# EAGLE design Octaplexerv6.1 (EAGLE 7.5.0)
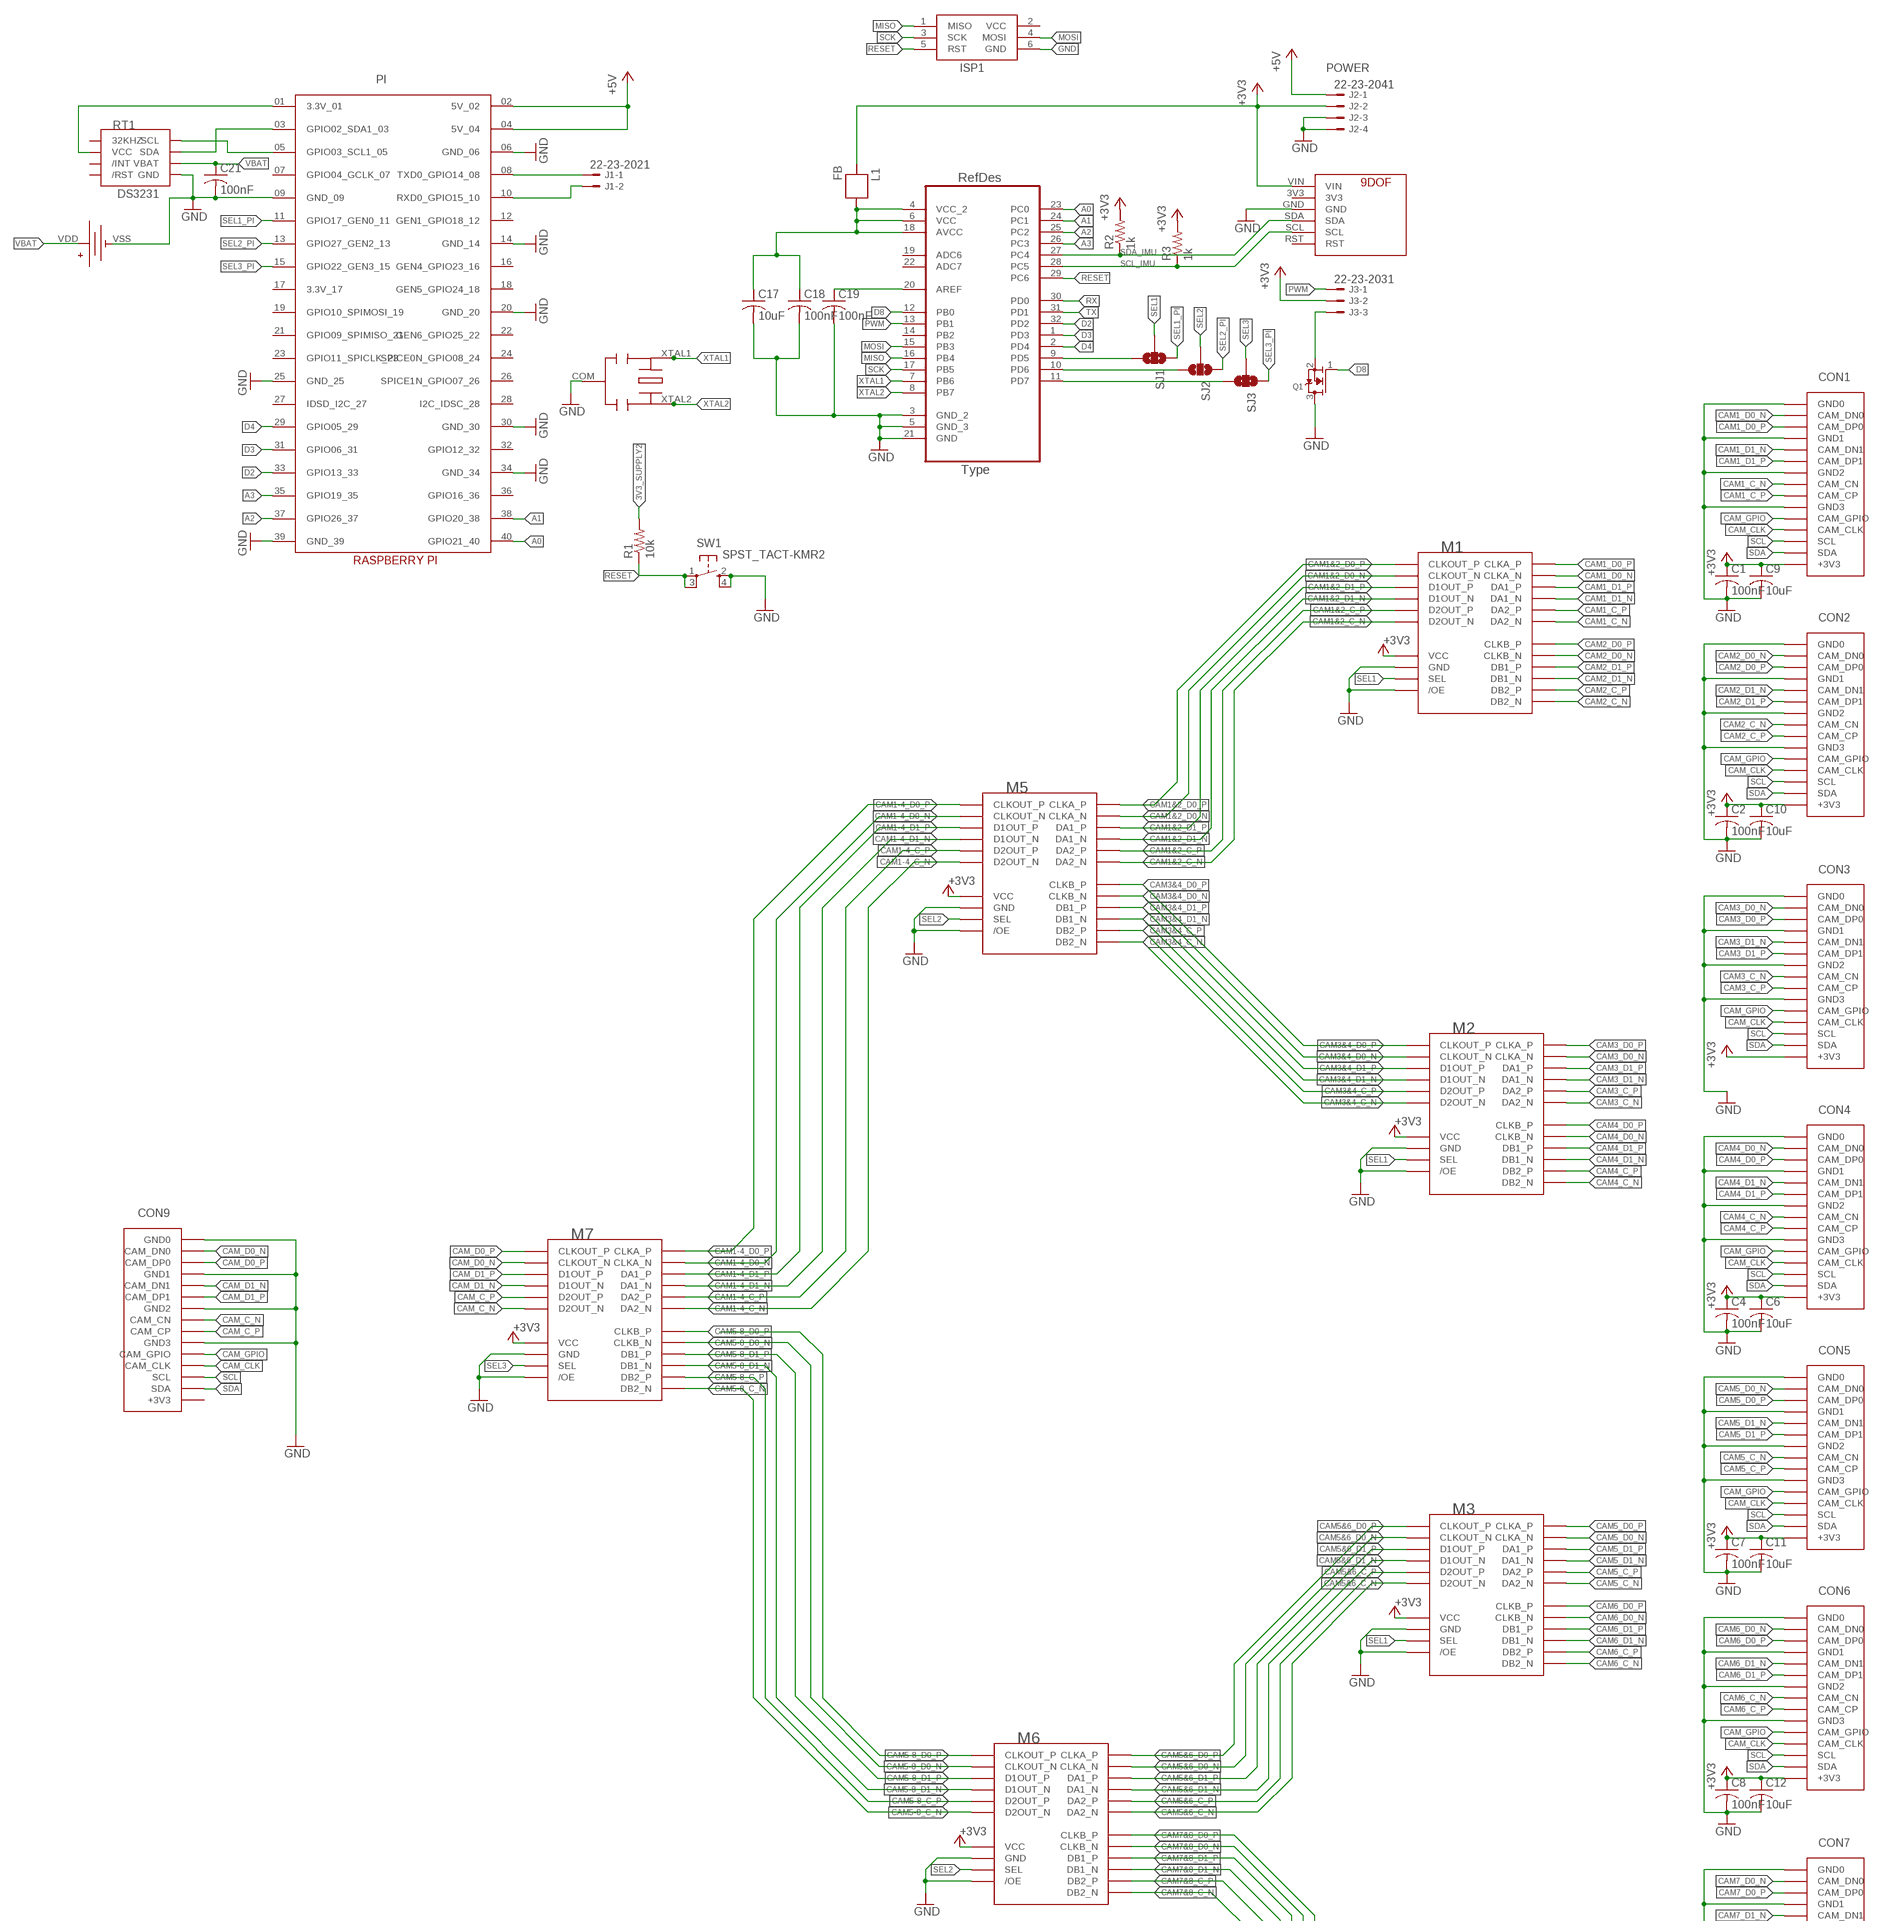
[diagram p0: schematic, sheet 1, part 1 of 2]
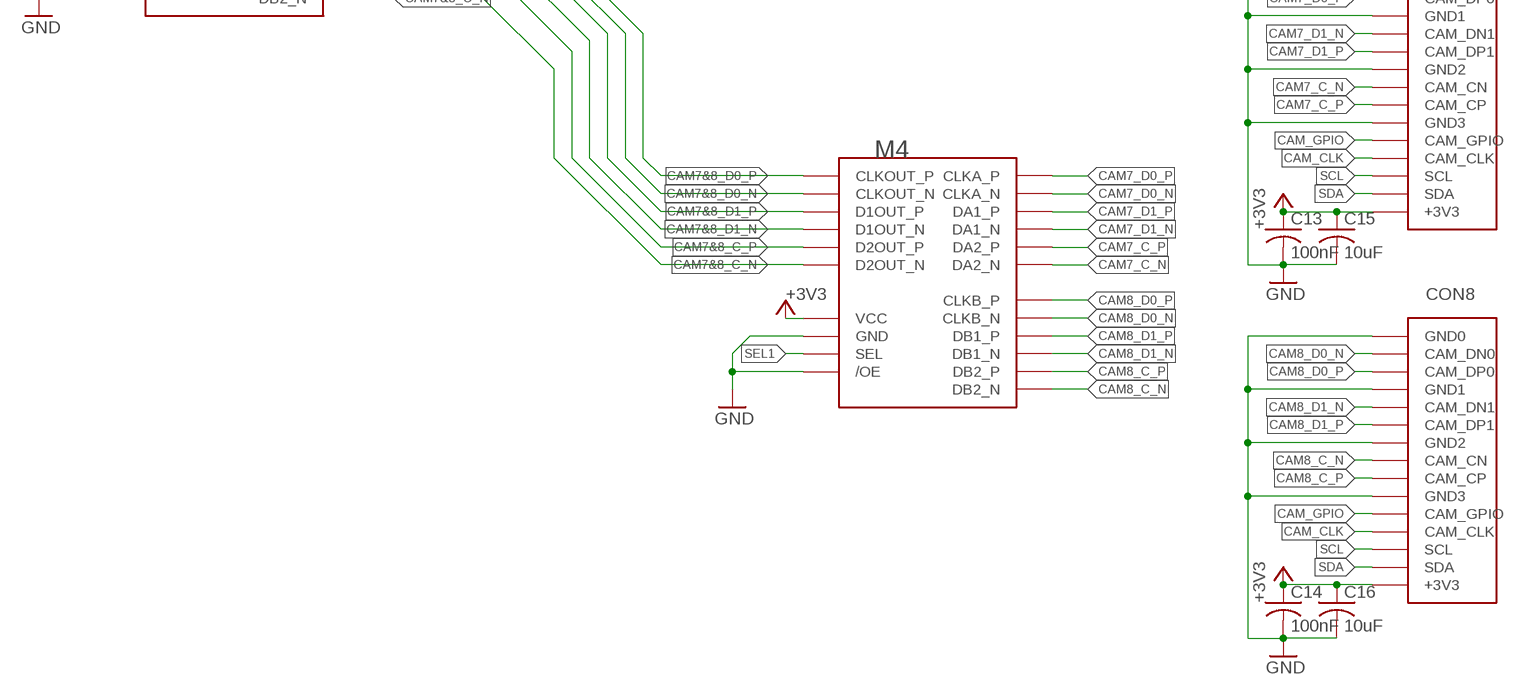
[diagram p1: schematic, sheet 1, part 2 of 2]

## Parts
C1  100nF  C-USC0603  [C0603]
C2  100nF  C-USC0603  [C0603]
C4  100nF  C-USC0603  [C0603]
C6  10uF  C-USC0603  [C0603]
C7  100nF  C-USC0603  [C0603]
C8  100nF  C-USC0603  [C0603]
C9  10uF  C-USC0603  [C0603]
C10  10uF  C-USC0603  [C0603]
C11  10uF  C-USC0603  [C0603]
C12  10uF  C-USC0603  [C0603]
C13  100nF  C-USC0603  [C0603]
C14  100nF  C-USC0603  [C0603]
C15  10uF  C-USC0603  [C0603]
C16  10uF  C-USC0603  [C0603]
C17  10uF  C-USC0603  [C0603]
C18  100nF  C-USC0603  [C0603]
C19  100nF  C-USC0603  [C0603]
C21  100nF  C-USC0603  [C0603]
CON1  SLW15S-1C7LF  [SLW15R-1C7LF]
CON2  SLW15S-1C7LF  [SLW15R-1C7LF]
CON3  SLW15S-1C7LF  [SLW15R-1C7LF]
CON4  SLW15S-1C7LF  [SLW15R-1C7LF]
CON5  SLW15S-1C7LF  [SLW15R-1C7LF]
CON6  SLW15S-1C7LF  [SLW15R-1C7LF]
CON7  SLW15S-1C7LF  [SLW15R-1C7LF]
CON8  SLW15S-1C7LF  [SLW15R-1C7LF]
CON9  SLW15S-1C7LF  [SLW15R-1C7LF]
ISP1  AVRISP-6  [AVRISP]
J1  22-23-2021  [22-23-2021]
J2  22-23-2041  [22-23-2041]
J3  22-23-2031  [22-23-2031]
L1  FB  [0603]
M1  FSA642  [FSA642]
M2  FSA642  [FSA642]
M3  FSA642  [FSA642]
M4  FSA642  [FSA642]
M5  FSA642  [FSA642]
M6  FSA642  [FSA642]
M7  FSA642  [FSA642]
PI  RASPBERRYPI_SHIELD  [RASPBERRYPI_SHIELD]
Q1  MOSFET-NREFLOW  [SOT23]
R1  10k  R-US_R0603  [R0603]
R2  1k  R-US_R0603  [R0603]
R3  1k  R-US_R0603  [R0603]
RT1  DS3231M  [SO-8]
S1  CR-1220/HFN  [CR-1220/HFN]
SJ1  SOLDERJUMPER_2WAYPASTE2&3  [SJ_3_PASTE2&3]
SJ2  SOLDERJUMPER_2WAYPASTE2&3  [SJ_3_PASTE2&3]
SJ3  SOLDERJUMPER_2WAYPASTE2&3  [SJ_3_PASTE2&3]
SW1  SPST_TACT-KMR2  [KMR2]
U1  ATMEGA328P-AU  [QFP80P900X900X120-32N]
U$2  9DOF-BNO055  [9DOF_FLAT]
X1  RESONATOR-PRQC  [PRQC]

## Nets
3V3_SUPPLY2: C17.1 C18.1 L1.1 R1.2 U1.4(VCC_2) U1.6(VCC) U1.18(AVCC)
+3V3: C1.1 C2.1 C4.1 C6.1 C7.1 C8.1 C9.1 C10.1 C11.1 C12.1 C13.1 C14.1 C15.1 C16.1 CON1.3.3V(+3V3) CON2.3.3V(+3V3) CON3.3.3V(+3V3) CON4.3.3V(+3V3) CON5.3.3V(+3V3) CON6.3.3V(+3V3) CON7.3.3V(+3V3) CON8.3.3V(+3V3) J2.2 J3.2 L1.2 M1.VCC M2.VCC M3.VCC M4.VCC M5.VCC M6.VCC M7.VCC R2.2 R3.2 U$2.VIN
+5V: J2.1 PI.02(5V_02) PI.04(5V_04)
A0: PI.40(GPIO21_40) U1.23(PC0)
A1: PI.38(GPIO20_38) U1.24(PC1)
A2: PI.37(GPIO26_37) U1.25(PC2)
A3: PI.35(GPIO19_35) U1.26(PC3)
CAM1&2_C_N: M1.D2N(D2OUT_N) M5.DA2N(DA2_N)
CAM1&2_C_P: M1.D2P(D2OUT_P) M5.DA2P(DA2_P)
CAM1&2_D0_N: M1.CLKN(CLKOUT_N) M5.CLKAN(CLKA_N)
CAM1&2_D0_P: M1.CLKP(CLKOUT_P) M5.CLKAP(CLKA_P)
CAM1&2_D1_N: M1.D1N(D1OUT_N) M5.DA1N(DA1_N)
CAM1&2_D1_P: M1.D1P(D1OUT_P) M5.DA1P(DA1_P)
CAM1-4_C_N: M5.D2N(D2OUT_N) M7.DA2N(DA2_N)
CAM1-4_C_P: M5.D2P(D2OUT_P) M7.DA2P(DA2_P)
CAM1-4_D0_N: M5.CLKN(CLKOUT_N) M7.CLKAN(CLKA_N)
CAM1-4_D0_P: M5.CLKP(CLKOUT_P) M7.CLKAP(CLKA_P)
CAM1-4_D1_N: M5.D1N(D1OUT_N) M7.DA1N(DA1_N)
CAM1-4_D1_P: M5.D1P(D1OUT_P) M7.DA1P(DA1_P)
CAM1_C_N: CON1.CAM_C_N(CAM_CN) M1.DA2N(DA2_N)
CAM1_C_P: CON1.CAM_C_P(CAM_CP) M1.DA2P(DA2_P)
CAM1_D0_N: CON1.CAM_D0_N(CAM_DN0) M1.CLKAN(CLKA_N)
CAM1_D0_P: CON1.CAM_D0_P(CAM_DP0) M1.CLKAP(CLKA_P)
CAM1_D1_N: CON1.CAM_D1_N(CAM_DN1) M1.DA1N(DA1_N)
CAM1_D1_P: CON1.CAM_D1_P(CAM_DP1) M1.DA1P(DA1_P)
CAM2_C_N: CON2.CAM_C_N(CAM_CN) M1.DB2N(DB2_N)
CAM2_C_P: CON2.CAM_C_P(CAM_CP) M1.DB2P(DB2_P)
CAM2_D0_N: CON2.CAM_D0_N(CAM_DN0) M1.CLKBN(CLKB_N)
CAM2_D0_P: CON2.CAM_D0_P(CAM_DP0) M1.CLKBP(CLKB_P)
CAM2_D1_N: CON2.CAM_D1_N(CAM_DN1) M1.DB1N(DB1_N)
CAM2_D1_P: CON2.CAM_D1_P(CAM_DP1) M1.DB1P(DB1_P)
CAM3&4_C_N: M2.D2N(D2OUT_N) M5.DB2N(DB2_N)
CAM3&4_C_P: M2.D2P(D2OUT_P) M5.DB2P(DB2_P)
CAM3&4_D0_N: M2.CLKN(CLKOUT_N) M5.CLKBN(CLKB_N)
CAM3&4_D0_P: M2.CLKP(CLKOUT_P) M5.CLKBP(CLKB_P)
CAM3&4_D1_N: M2.D1N(D1OUT_N) M5.DB1N(DB1_N)
CAM3&4_D1_P: M2.D1P(D1OUT_P) M5.DB1P(DB1_P)
CAM3_C_N: CON3.CAM_C_N(CAM_CN) M2.DA2N(DA2_N)
CAM3_C_P: CON3.CAM_C_P(CAM_CP) M2.DA2P(DA2_P)
CAM3_D0_N: CON3.CAM_D0_N(CAM_DN0) M2.CLKAN(CLKA_N)
CAM3_D0_P: CON3.CAM_D0_P(CAM_DP0) M2.CLKAP(CLKA_P)
CAM3_D1_N: CON3.CAM_D1_N(CAM_DN1) M2.DA1N(DA1_N)
CAM3_D1_P: CON3.CAM_D1_P(CAM_DP1) M2.DA1P(DA1_P)
CAM4_C_N: CON4.CAM_C_N(CAM_CN) M2.DB2N(DB2_N)
CAM4_C_P: CON4.CAM_C_P(CAM_CP) M2.DB2P(DB2_P)
CAM4_D0_N: CON4.CAM_D0_N(CAM_DN0) M2.CLKBN(CLKB_N)
CAM4_D0_P: CON4.CAM_D0_P(CAM_DP0) M2.CLKBP(CLKB_P)
CAM4_D1_N: CON4.CAM_D1_N(CAM_DN1) M2.DB1N(DB1_N)
CAM4_D1_P: CON4.CAM_D1_P(CAM_DP1) M2.DB1P(DB1_P)
CAM5&6_C_N: M3.D2N(D2OUT_N) M6.DA2N(DA2_N)
CAM5&6_C_P: M3.D2P(D2OUT_P) M6.DA2P(DA2_P)
CAM5&6_D0_N: M3.CLKN(CLKOUT_N) M6.CLKAN(CLKA_N)
CAM5&6_D0_P: M3.CLKP(CLKOUT_P) M6.CLKAP(CLKA_P)
CAM5&6_D1_N: M3.D1N(D1OUT_N) M6.DA1N(DA1_N)
CAM5&6_D1_P: M3.D1P(D1OUT_P) M6.DA1P(DA1_P)
CAM5-8_C_N: M6.D2N(D2OUT_N) M7.DB2N(DB2_N)
CAM5-8_C_P: M6.D2P(D2OUT_P) M7.DB2P(DB2_P)
CAM5-8_D0_N: M6.CLKN(CLKOUT_N) M7.CLKBN(CLKB_N)
CAM5-8_D0_P: M6.CLKP(CLKOUT_P) M7.CLKBP(CLKB_P)
CAM5-8_D1_N: M6.D1N(D1OUT_N) M7.DB1N(DB1_N)
CAM5-8_D1_P: M6.D1P(D1OUT_P) M7.DB1P(DB1_P)
CAM5_C_N: CON5.CAM_C_N(CAM_CN) M3.DA2N(DA2_N)
CAM5_C_P: CON5.CAM_C_P(CAM_CP) M3.DA2P(DA2_P)
CAM5_D0_N: CON5.CAM_D0_N(CAM_DN0) M3.CLKAN(CLKA_N)
CAM5_D0_P: CON5.CAM_D0_P(CAM_DP0) M3.CLKAP(CLKA_P)
CAM5_D1_N: CON5.CAM_D1_N(CAM_DN1) M3.DA1N(DA1_N)
CAM5_D1_P: CON5.CAM_D1_P(CAM_DP1) M3.DA1P(DA1_P)
CAM6_C_N: CON6.CAM_C_N(CAM_CN) M3.DB2N(DB2_N)
CAM6_C_P: CON6.CAM_C_P(CAM_CP) M3.DB2P(DB2_P)
CAM6_D0_N: CON6.CAM_D0_N(CAM_DN0) M3.CLKBN(CLKB_N)
CAM6_D0_P: CON6.CAM_D0_P(CAM_DP0) M3.CLKBP(CLKB_P)
CAM6_D1_N: CON6.CAM_D1_N(CAM_DN1) M3.DB1N(DB1_N)
CAM6_D1_P: CON6.CAM_D1_P(CAM_DP1) M3.DB1P(DB1_P)
CAM7&8_C_N: M4.D2N(D2OUT_N) M6.DB2N(DB2_N)
CAM7&8_C_P: M4.D2P(D2OUT_P) M6.DB2P(DB2_P)
CAM7&8_D0_N: M4.CLKN(CLKOUT_N) M6.CLKBN(CLKB_N)
CAM7&8_D0_P: M4.CLKP(CLKOUT_P) M6.CLKBP(CLKB_P)
CAM7&8_D1_N: M4.D1N(D1OUT_N) M6.DB1N(DB1_N)
CAM7&8_D1_P: M4.D1P(D1OUT_P) M6.DB1P(DB1_P)
CAM7_C_N: CON7.CAM_C_N(CAM_CN) M4.DA2N(DA2_N)
CAM7_C_P: CON7.CAM_C_P(CAM_CP) M4.DA2P(DA2_P)
CAM7_D0_N: CON7.CAM_D0_N(CAM_DN0) M4.CLKAN(CLKA_N)
CAM7_D0_P: CON7.CAM_D0_P(CAM_DP0) M4.CLKAP(CLKA_P)
CAM7_D1_N: CON7.CAM_D1_N(CAM_DN1) M4.DA1N(DA1_N)
CAM7_D1_P: CON7.CAM_D1_P(CAM_DP1) M4.DA1P(DA1_P)
CAM8_C_N: CON8.CAM_C_N(CAM_CN) M4.DB2N(DB2_N)
CAM8_C_P: CON8.CAM_C_P(CAM_CP) M4.DB2P(DB2_P)
CAM8_D0_N: CON8.CAM_D0_N(CAM_DN0) M4.CLKBN(CLKB_N)
CAM8_D0_P: CON8.CAM_D0_P(CAM_DP0) M4.CLKBP(CLKB_P)
CAM8_D1_N: CON8.CAM_D1_N(CAM_DN1) M4.DB1N(DB1_N)
CAM8_D1_P: CON8.CAM_D1_P(CAM_DP1) M4.DB1P(DB1_P)
CAM_C_N: CON9.CAM_C_N(CAM_CN) M7.D2N(D2OUT_N)
CAM_C_P: CON9.CAM_C_P(CAM_CP) M7.D2P(D2OUT_P)
CAM_CLK: CON1.CAM_CLK CON2.CAM_CLK CON3.CAM_CLK CON4.CAM_CLK CON5.CAM_CLK CON6.CAM_CLK CON7.CAM_CLK CON8.CAM_CLK CON9.CAM_CLK
CAM_D0_N: CON9.CAM_D0_N(CAM_DN0) M7.CLKN(CLKOUT_N)
CAM_D0_P: CON9.CAM_D0_P(CAM_DP0) M7.CLKP(CLKOUT_P)
CAM_D1_N: CON9.CAM_D1_N(CAM_DN1) M7.D1N(D1OUT_N)
CAM_D1_P: CON9.CAM_D1_P(CAM_DP1) M7.D1P(D1OUT_P)
CAM_GPIO: CON1.CAM_GPIO CON2.CAM_GPIO CON3.CAM_GPIO CON4.CAM_GPIO CON5.CAM_GPIO CON6.CAM_GPIO CON7.CAM_GPIO CON8.CAM_GPIO CON9.CAM_GPIO
D2: PI.33(GPIO13_33) U1.32(PD2)
D3: PI.31(GPIO06_31) U1.1(PD3)
D4: PI.29(GPIO05_29) U1.2(PD4)
D8: Q1.1(G) U1.12(PB0)
GND: C1.2 C2.2 C4.2 C6.2 C7.2 C8.2 C9.2 C10.2 C11.2 C12.2 C13.2 C14.2 C15.2 C16.2 C17.2 C18.2 C19.2 C21.2 CON1.GND1 CON1.GND2 CON1.GND3 CON1.GND(GND0) CON2.GND1 CON2.GND2 CON2.GND3 CON2.GND(GND0) CON3.GND1 CON3.GND2 CON3.GND3 CON3.GND(GND0) CON4.GND1 CON4.GND2 CON4.GND3 CON4.GND(GND0) CON5.GND1 CON5.GND2 CON5.GND3 CON5.GND(GND0) CON6.GND1 CON6.GND2 CON6.GND3 CON6.GND(GND0) CON7.GND1 CON7.GND2 CON7.GND3 CON7.GND(GND0) CON8.GND1 CON8.GND2 CON8.GND3 CON8.GND(GND0) CON9.GND1 CON9.GND2 CON9.GND3 CON9.GND(GND0) ISP1.6(GND) J2.3 J2.4 M1./OE M1.GND M2./OE M2.GND M3./OE M3.GND M4./OE M4.GND M5./OE M5.GND M6./OE M6.GND M7./OE M7.GND PI.06(GND_06) PI.09(GND_09) PI.14(GND_14) PI.20(GND_20) PI.25(GND_25) PI.30(GND_30) PI.34(GND_34) PI.39(GND_39) Q1.3(D) RT1.5(GND) S1.VSS SW1.2(S) SW1.4(S1) U1.3(GND_2) U1.5(GND_3) U1.21(GND) U$2.GND X1.COM
MISO: ISP1.1(MISO) U1.16(PB4)
MOSI: ISP1.4(MOSI) U1.15(PB3)
N$1: J1.1 PI.08(TXD0_GPIO14_08)
N$2: SJ3.3 U1.11(PD7)
N$3: C19.1 U1.20(AREF)
N$4: SJ2.3 U1.10(PD6)
N$5: SJ1.3 U1.9(PD5)
N$7: J1.2 PI.10(RXD0_GPIO15_10)
N$8: J3.3 Q1.2(S)
N$10: PI.03(GPIO02_SDA1_03) RT1.7(SDA)
N$11: PI.05(GPIO03_SCL1_05) RT1.8(SCL)
N$12: PI.01(3.3V_01) RT1.2(VCC)
PWM: J3.1 U1.13(PB1)
RESET: ISP1.5(RST) R1.1 SW1.1(P) SW1.3(P1) U1.29(PC6)
RX: U1.30(PD0)
SCK: ISP1.3(SCK) U1.17(PB5)
SCL: CON1.SCL CON2.SCL CON3.SCL CON4.SCL CON5.SCL CON6.SCL CON7.SCL CON8.SCL CON9.SCL
SCL_IMU: R3.1 U1.28(PC5) U$2.SCL
SDA: CON1.SDA CON2.SDA CON3.SDA CON4.SDA CON5.SDA CON6.SDA CON7.SDA CON8.SDA CON9.SDA
SDA_IMU: R2.1 U1.27(PC4) U$2.SDA
SEL1: M1.SEL M2.SEL M3.SEL M4.SEL SJ1.2
SEL1_PI: PI.11(GPIO17_GEN0_11) SJ1.1
SEL2: M5.SEL M6.SEL SJ2.2
SEL2_PI: PI.13(GPIO27_GEN2_13) SJ2.1
SEL3: M7.SEL SJ3.2
SEL3_PI: PI.15(GPIO22_GEN3_15) SJ3.1
TX: U1.31(PD1)
VBAT: C21.1 RT1.6(VBAT) S1.VDD
XTAL1: U1.7(PB6) X1.XTAL1
XTAL2: U1.8(PB7) X1.XTAL2
Unconnected: CON9.3.3V(+3V3) PI.07(GPIO04_GCLK_07) PI.12(GEN1_GPIO18_12) PI.16(GEN4_GPIO23_16) PI.17(3.3V_17) PI.18(GEN5_GPIO24_18) PI.19(GPIO10_SPIMOSI_19) PI.21(GPIO09_SPIMISO_21) PI.22(GEN6_GPIO25_22) PI.23(GPIO11_SPICLK_23) PI.24(SPICE0N_GPIO08_24) PI.26(SPICE1N_GPIO07_26) PI.27(IDSD_I2C_27) PI.28(I2C_IDSC_28) PI.32(GPIO12_32) PI.36(GPIO16_36) RT1.1(32KHZ) RT1.3(/INT) RT1.4(/RST) U1.14(PB2) U1.19(ADC6) U1.22(ADC7) U$2.3V3 U$2.RST

## Notes on the sheet
- POWER

## Power pins joined to a net without a drawn wire
VCC: ISP1.2(VCC)

## Library data of the parts
C1 C2 C4 C6-C19 C21 = adafruit:C-US: CAPACITOR, American symbol
CON1-CON9 = MSGC:SLW15S-1C7LF
ISP1 = adafruit:AVRISP: AVR ISP HEADER Standard 6 pin header for AVR programming
J1 = con-molex:22-23-2021: .100" (2.54mm) Center Header - 2 Pin; MF: MOLEX; MPN: 22-23-2021; OC_FARNELL: 1462926; OC_NEWARK: 25C3832
J2 = con-molex:22-23-2041: .100" (2.54mm) Center Header - 4 Pin; MF: MOLEX; MPN: 22-23-2041; OC_FARNELL: 1462920; OC_NEWARK: 38C0355
J3 = con-molex:22-23-2031: .100" (2.54mm) Center Header - 3 Pin; MF: MOLEX; MPN: 22-23-2031; OC_FARNELL: 1462950; OC_NEWARK: 30C0862
L1 = SparkFun-Passives:FB
M1-M7 = MSGC:FSA642
PI = MSGC:RASPBERRYPI_SHIELD
Q1 = adafruit:MOSFET-N: N-Channel Mosfet 2N7002E - 60V 260mA SOT23 [Digikey: 2N7002ET1GOSTR-ND] - REEL BSH103 - 30V 850mA SOT23 [Digikey: 568-5013-1-ND]
R1-R3 = adafruit:R-US_: RESISTOR, American symbol
RT1 = MSGC:DS3231M
S1 = MSGC:CR-1220/HFN
SJ1-SJ3 = SparkFun-Retired:SOLDERJUMPER_2WAY: Solder Jumper 2 way solder jumper
SW1 = adafruit:SPST_TACT: SMT 6mm switch, EVQQ2 series http://www.ladyada.net/library/eagle
U1 = Atmel-ATMEGA328P-AU:ATMEGA328P-AU; DESCRIPTION: 8-bit Microcontroller with In-System Programmable Flash; MPN: ATMEGA328P-AU; OC_FARNELL: 1715486; OC_NEWARK: 14R4631; PACKAGE: TQFP-32; SUPPLIER: Atmel
U$2 = MSGC:9DOF-BNO055
X1 = MSGC:RESONATOR-PRQC

## Board
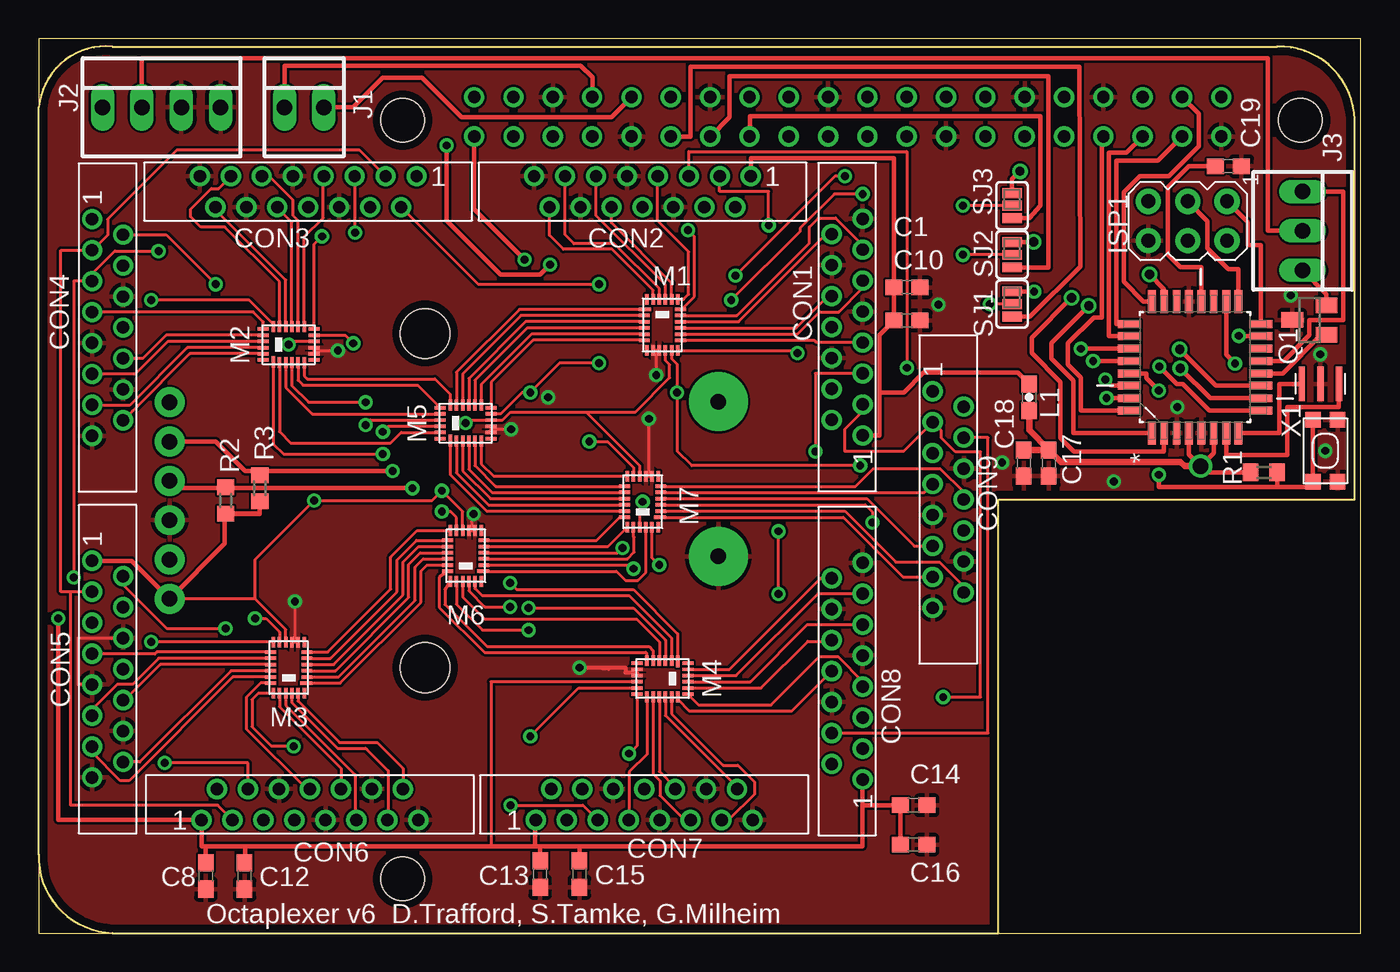
[diagram p2: board, top side]
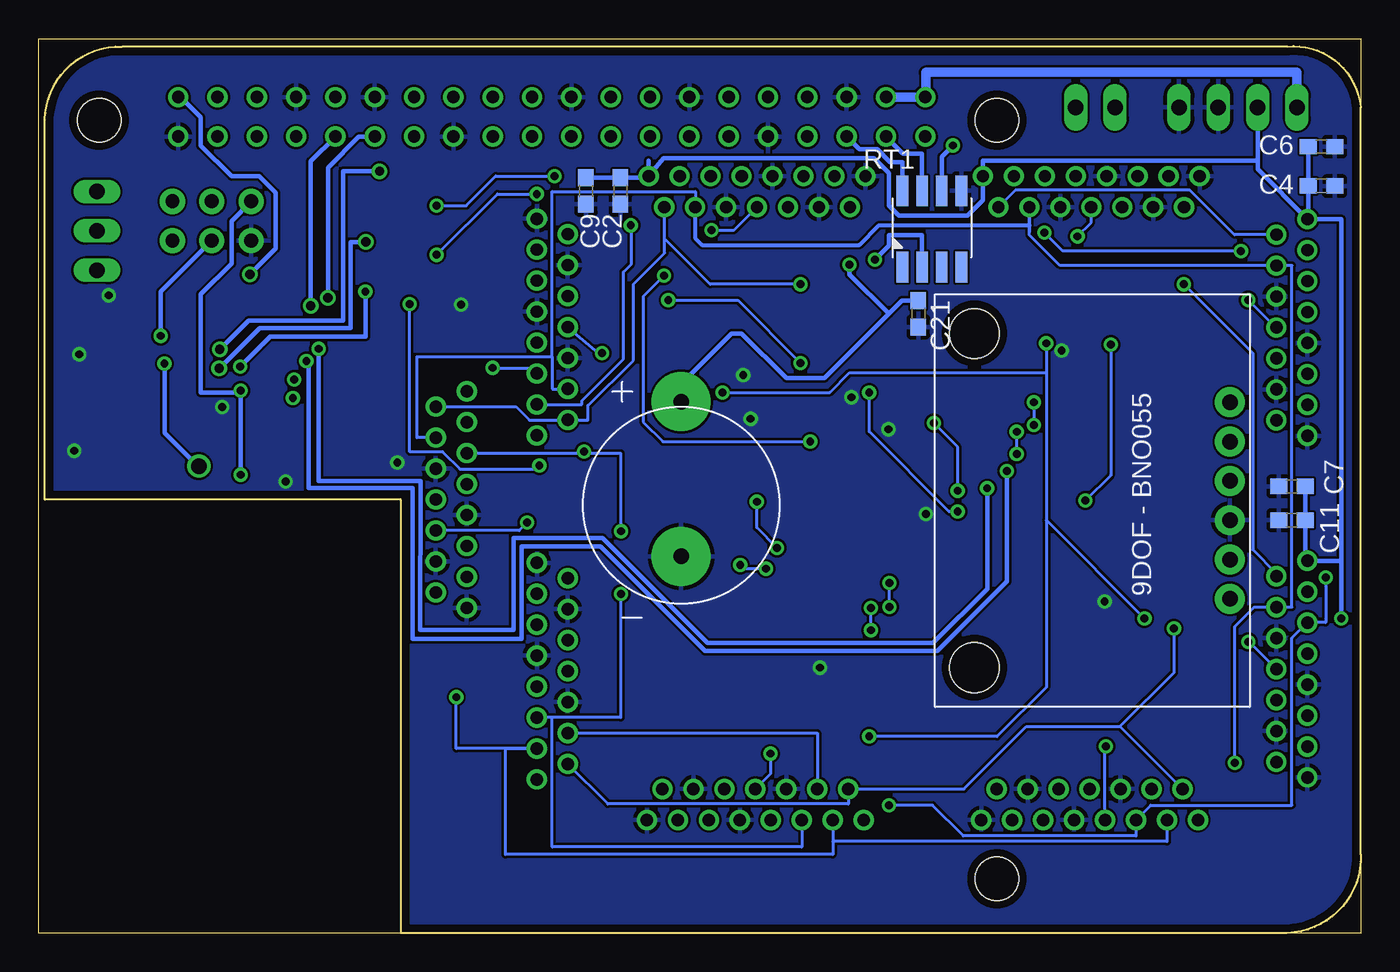
[diagram p3: board, bottom side, seen from below]

Size 85.39 x 57.77 mm. Coordinates in mm from the lower left corner, seen from the top.
Outline: 0,0 85.39,0 85.39,57.77 0,57.77 0,0
Copper layers (1*16): Top 0.035mm / dielectric 1.5mm / Bottom 0.035mm
Design rules "default *": minimum track width 8mil, minimum drill 20mil, track to track 6mil, track to pad 6mil, pad to pad 6mil, via to via 6mil, smd to smd 6mil, copper to edge 20mil, drill to drill 8mil, minimum pad ring 10mil, minimum via ring 8mil, stop-mask expansion 4mil, vias tented up to drill 0mil, thermal gap 10mil

### Footprints (pad centres in the part's own frame; a part is rotated, then mirrored left to right if it is on the bottom)
C0603 = smd 1.1 x 1: 1 -0.85,0; 2 0.85,0
SLW15R-1C7LF = drill 0.8: 3.3V 0,0; CAM_C_N 7,2; CAM_C_P 6,0; CAM_CLK 3,2; CAM_D0_N 13,2; CAM_D0_P 12,0; CAM_D1_N 10,0; CAM_D1_P 9,2; CAM_GPIO 4,0; GND 5,2; GND1 8,0; GND2 11,2; GND3 14,0; SCL 2,0; SDA 1,2
AVRISP = drill 0.9 pad 1.626: 1 -1.27,2.54; 2 1.27,2.54; 3 -1.27,0; 4 1.27,0; 5 -1.27,-2.54; 6 1.27,-2.54
22-23-2021 = drill 1 long: 1 -1.27,0; 2 1.27,0
22-23-2041 = drill 1 long: 1 -3.81,0; 2 -1.27,0; 3 1.27,0; 4 3.81,0
22-23-2031 = drill 1 long: 1 -2.54,0; 2 0,0; 3 2.54,0
0603 = smd 1.1 x 1: 1 -0.85,0; 2 0.85,0
FSA642 = smd 0.225 x 0.703: /OE -0.6,-1.649; CLKBN -0.6,1.649; CLKBP -0.2,1.649; DA2N 1,-1.649; DB1N 0.2,1.649; DB1P 0.6,1.649; DB2P 1,1.649; GND -0.2,-1.649; NC1 -1,-1.649; NC2 -1,1.649; SEL 0.6,-1.649; VCC 0.2,-1.649 | smd 0.703 x 0.225: CLKAN 1.169,0.2; CLKAP 1.169,0.6; CLKN -1.169,0.6; D1N -1.169,-0.2; D1P -1.169,0.2; D2N -1.169,-1; D2P -1.169,-0.6; DA1N 1.169,-0.6; DA1P 1.169,-0.2; DA2P 1.169,-1; DB2N 1.169,1 | smd 0.763 x 0.225: CLKP -1.119,1
RASPBERRYPI_SHIELD = drill 0.8: 01 8.128,51.46; 02 8.128,54; 03 10.668,51.46; 04 10.668,54; 05 13.208,51.46; 06 13.208,54; 07 15.748,51.46; 08 15.748,54; 09 18.288,51.46; 10 18.288,54; 11 20.828,51.46; 12 20.828,54; 13 23.368,51.46; 14 23.368,54; 15 25.908,51.46; 16 25.908,54; 17 28.448,51.46; 18 28.448,54; 19 30.988,51.46; 20 30.988,54; 21 33.528,51.46; 22 33.528,54; 23 36.068,51.46; 24 36.068,54; 25 38.608,51.46; 26 38.608,54; 27 41.148,51.46; 28 41.148,54; 29 43.688,51.46; 30 43.688,54; 31 46.228,51.46; 32 46.228,54; 33 48.768,51.46; 34 48.768,54; 35 51.308,51.46; 36 51.308,54; 37 53.848,51.46; 38 53.848,54; 39 56.388,51.46; 40 56.388,54 | hole 2.8: 3.5,52.5; 3.5,3.5; 61.5,52.5
SOT23 = smd 1 x 1.4: 1 -0.95,-1.1; 2 0.95,-1.1; 3 0,1.1
R0603 = smd 1 x 1.1: 1 -0.85,0; 2 0.85,0
SO-8 = smd 0.762 x 1.98: 1 0,0; 2 1.27,0; 3 2.54,0; 4 3.81,0; 5 3.81,4.93; 6 2.54,4.93; 7 1.27,4.93; 8 0,4.93
CR-1220/HFN = drill 1 pad 3.81: VDD 0,0; VSS 0,10
SJ_3_PASTE2&3 = smd 0.635 x 1.27: 1 -0.813,0; 2 0,0; 3 0.813,0
KMR2 = smd 1 x 1: 1 2,0.8; 2 2,-0.8; 3 -2,0.8; 4 -2,-0.8
QFP80P900X900X120-32N = smd 1.473 x 0.508: 1 -4.242,2.794; 2 -4.242,2.007; 3 -4.242,1.194; 4 -4.242,0.406; 5 -4.242,-0.406; 6 -4.242,-1.194; 7 -4.242,-2.007; 8 -4.242,-2.794; 17 4.242,-2.794; 18 4.242,-2.007; 19 4.242,-1.194; 20 4.242,-0.406; 21 4.242,0.406; 22 4.242,1.194; 23 4.242,2.007; 24 4.242,2.794 | smd 0.508 x 1.473: 9 -2.794,-4.242; 10 -2.007,-4.242; 11 -1.194,-4.242; 12 -0.406,-4.242; 13 0.406,-4.242; 14 1.194,-4.242; 15 2.007,-4.242; 16 2.794,-4.242; 25 2.794,4.242; 26 2.007,4.242; 27 1.194,4.242; 28 0.406,4.242; 29 -0.406,4.242; 30 -1.194,4.242; 31 -2.007,4.242; 32 -2.794,4.242
9DOF_FLAT = drill 1 pad 1.93: 3V3 14.605,16.51; GND 12.065,16.51; RST 4.445,16.51; SCL 6.985,16.51; SDA 9.525,16.51; VIN 17.145,16.51 | hole 3.2: 0,0; 21.59,0
PRQC = smd 0.4 x 2.25: COM 0,0; XTAL1 -1.2,0; XTAL2 1.2,0

### Placement (x,y rotation side)
C1  56.08,41.71 0 top
C2  47.82,47.94 270 bottom
C4  2.54,48.26 0 bottom
C6  2.54,50.8 0 bottom
C7  4.45,28.85 180 bottom
C8  10.79,3.69 270 top
C9  50.05,47.94 270 bottom
C10  56.08,39.57 0 top
C11  4.45,26.67 180 bottom
C12  13.3,3.69 270 top
C13  32.38,3.81 270 top
C14  56.52,8.26 0 top
C15  34.92,3.81 270 top
C16  56.52,5.71 0 top
C17  65.25,30.36 270 top
C18  63.62,30.36 270 top
C19  76.83,49.53 0 top
C21  28.57,40.01 270 bottom
CON1  53.22,32.15 90 top
CON2  46,48.9 180 top
CON3  24.41,48.9 180 top
CON4  3.45,46.12 270 top
CON5  3.45,24.05 270 top
CON6  10.52,7.3 0 top
CON7  32.11,7.3 0 top
CON8  53.22,9.92 90 top
CON9  57.75,35 270 top
ISP1  74.22,46 270 top
J1  17.14,53.34 0 top
J2  7.94,53.34 0 top
J3  81.64,45.36 270 top
L1  63.98,34.61 90 top
M1  40.28,39.29 0 top
M2  16.15,38.02 90 top
M3  16.15,17.14 180 top
M4  40.28,16.43 270 top
M5  27.58,32.94 90 top
M6  27.58,24.37 180 top
M7  39.01,27.86 180 top
PI  20,0 0 top
Q1  82.07,39.61 90 top
R1  79.14,29.77 180 top
R2  12.06,27.94 270 top
R3  14.29,28.73 270 top
RT1  29.61,43.02 0 bottom
S1  43.89,34.33 180 bottom
SJ1  62.87,40.64 90 top
SJ2  62.87,43.81 90 top
SJ3  62.87,46.99 90 top
SW1  83.11,31.15 90 top
U1  74.69,36.55 90 top
U$2  24.96,38.73 270 bottom
X1  82.79,35.48 180 top

### Tracks (layer width: path | path; a pad name or v marks a point on that pad's centre or on a via)
3V3_SUPPLY2  (via drill 0.51, 1)
  Top 0.305: 76.7,39.9 U1.18 76.7,37.36 v77.27,36.79 | R1.2 75.45,29.77 v75.05,30.16 | U1.4 74.28,30.93 v75.05,30.16 | U1.6 75.89,31 v75.05,30.16
  Top 0.406: C18.1 C17.1 | L1.1 63.98,32.48 C17.1 | C17.1 66.02,30.44 73.74,30.44 74.02,30.16 v75.05,30.16
  Bottom 0.305: v77.27,36.79 77.27,32.31 75.13,30.16 v75.05,30.16
+3V3  (via drill 0.51)
  Top 0.203: M4.VCC 29.21,16.23 29.21,5.6 | M3.VCC 15.95,19.61 13.97,21.59 | 13.97,21.59 U$2.VIN | v27.58,32.94 27.78,33.14 M5.VCC 29.97,33.14 30.48,33.66 35.36,33.66 | 35.36,33.66 38.81,30.2 M7.VCC | 35.36,33.66 38.54,33.66 40.76,35.88 40.76,36.71 40.48,36.99 M1.VCC | M2.VCC 16.35,38.22 v16.15,38.02 | 13.97,21.59 13.97,24.13 v17.78,27.94 25.4,27.94 v26.04,28.57 27.38,27.23 M6.VCC
  Top 0.305: CON5.3.3V 5.99,24.05 U$2.VIN 12.03,25.16 12.03,27.07 14.29,27.07 R3.2 14.29,27.09 R2.2 | CON1.3.3V 54.29,32.15 54.29,34.92 | CON2.3.3V 46,50.05 55.23,50.05 C1.1 C10.1 54.29,38.63 54.29,34.92 | CON8.3.3V 53.22,8.26 | 34.92,5.6 53.22,5.6 53.22,8.26 | 34.92,5.6 32.38,5.6 | 32.38,5.6 32.07,5.6 | 32.07,5.6 32.07,7.3 CON7.3.3V | 10.79,5.6 10.52,5.6 CON6.3.3V 1.27,7.3 v1.27,20.32 | 10.79,5.6 13.34,5.6 | 13.34,5.6 29.21,5.6 32.07,5.6 | C16.1 C14.1 53.22,8.26 | C13.1 32.38,5.6 | C8.1 10.79,5.6 | J3.2 79.38,45.36 79.38,56.52 6.67,56.52 J2.2 | C15.1 34.92,5.6 | C12.1 13.34,4.54 13.34,5.6 | L1.2 63.24,36.2 57.15,36.2 55.88,34.92 54.29,34.92
  Bottom 0.203: v26.04,28.57 26.04,31.39 v27.58,32.94 | v16.15,38.02 16.15,29.57 v17.78,27.94
  Bottom 0.305: CON4.3.3V 1.27,46.12 1.27,24.05 | 1.27,24.05 CON5.3.3V | CON4.3.3V 6.67,49.33 6.67,49.89 | 6.67,49.89 J2.2 | 6.67,49.89 24.41,49.89 CON3.3.3V 24.41,47.35 25.4,46.35 29.84,46.35 30.48,46.99 30.48,49.09 31.43,50.05 45.05,50.05 CON2.3.3V | CON2.3.3V 46,49.89 | v1.27,20.32 1.27,24.05 | 2.33,24.05 CON5.3.3V | C7.1 C11.1 3.6,24.05 CON5.3.3V | C6.1 C4.1 3.39,46.12 CON4.3.3V | C9.1 C2.1 46,48.79 CON2.3.3V
+5V
  Bottom 0.61: J2.1 4.13,55.6 28.1,55.6 28.1,54 PI.02 PI.04
A0  (via drill 0.6)
  Top 0.305: U1.23 72.69,41.62 v71.75,42.55
  Bottom 0.305: v71.75,42.55 70.09,44.21 70.09,47.82 71.16,48.9 72.95,48.9 74.93,50.88 74.93,52.7 76.22,54 PI.40
A1
  Top 0.305: U1.24 71.36,40.79 70.09,42.07 70.09,47.86 71.12,48.9 72.98,48.9 74.93,50.84 74.93,52.92 PI.38
A2
  Top 0.305: PI.37 72.28,49.89 69.61,49.89 69.61,39.35 U1.25
A3
  Top 0.305: U1.26 69.14,38.56 69.14,50.4 70.25,50.4 PI.35
CAM1&2_C_N
  Top 0.203: M1.D2N 31.94,38.29 29.23,35.59 M5.DA2N
CAM1&2_C_P
  Top 0.203: M1.D2P 31.83,38.69 28.58,35.44 M5.DA2P
CAM1&2_D0_N
  Top 0.203: M1.CLKN 31.16,39.89 27.38,36.12 M5.CLKAN
CAM1&2_D0_P
  Top 0.203: M1.CLKP 31.05,40.29 26.98,36.23 M5.CLKAP
CAM1&2_D1_N
  Top 0.203: M1.D1N 31.55,39.09 28.18,35.72 28.18,35.71 M5.DA1N
CAM1&2_D1_P
  Top 0.203: M1.D1P 31.44,39.49 27.78,35.84 M5.DA1P
CAM1-4_C_N
  Top 0.203: M5.D2N 28.58,30.31 29.38,29.51 M7.DA2N
CAM1-4_C_P
  Top 0.203: M5.D2P 28.18,30.2 29.52,28.86 M7.DA2P
CAM1-4_D0_N
  Top 0.203: M5.CLKN 26.98,29.73 29.05,27.66 M7.CLKAN
CAM1-4_D0_P
  Top 0.203: M5.CLKP 26.58,29.62 28.94,27.26 M7.CLKAP
CAM1-4_D1_N
  Top 0.203: M5.D1N 27.78,29.96 29.29,28.45 M7.DA1N
CAM1-4_D1_P
  Top 0.203: M5.D1P 27.38,29.85 29.17,28.06 M7.DA1P
CAM1_C_N  (via drill 0.51 pad 0.81)
  Top 0.203: M1.DA2N 48.84,37.64 v49.01,37.47
  Bottom 0.203: v49.01,37.47 49.22,37.47 CON1.CAM_C_N
CAM1_C_P
  Top 0.203: M1.DA2P 50.09,38.29 50.2,38.18 53.19,38.18 CON1.CAM_C_P
CAM1_D0_N
  Top 0.203: M1.CLKAN 45.2,39.49 50.86,45.15 CON1.CAM_D0_N
CAM1_D0_P
  Top 0.203: M1.CLKAP 45.09,39.89 49.77,44.57 49.77,45.6 50.36,46.2 51.48,46.2 53.22,44.45 CON1.CAM_D0_P
CAM1_D1_N
  Top 0.203: M1.DA1N 49.01,38.69 50.44,40.13 51.67,40.13 53.22,41.67 CON1.CAM_D1_N
CAM1_D1_P
  Top 0.203: M1.DA1P 48.9,39.09 50.9,41.1 CON1.CAM_D1_P
CAM2_C_N  (via drill 0.51 pad 0.81)
  Top 0.203: M1.DB2N 41.52,40.29 42.35,41.13 42.35,45 v41.95,45.4
  Bottom 0.203: v41.95,45.4 40.49,45.4 CON2.CAM_C_N
CAM2_C_P
  Top 0.203: M1.DB2P 41.66,40.94 41.98,41.26 41.98,44.02 39.97,46.04 39.97,48.86 CON2.CAM_C_P
CAM2_D0_N
  Top 0.203: M1.CLKBN 39.68,41.52 37.04,44.17 33.9,44.17 32.98,45.09 32.98,46.88 CON2.CAM_D0_N
CAM2_D0_P
  Top 0.203: M1.CLKBP 40.08,41.63 37.18,44.54 34.57,44.54 34,45.11 CON2.CAM_D0_P
CAM2_D1_N
  Top 0.203: M1.DB1N 40.48,41.87 36,46.36 CON2.CAM_D1_N
CAM2_D1_P
  Top 0.203: M1.DB1P 40.88,41.98 36.99,45.88 36.99,46.88 CON2.CAM_D1_P
CAM3&4_C_N
  Top 0.203: M2.D2N 17.15,35.99 17.34,35.8 25.6,35.8 26.58,34.81 M5.DB2N
CAM3&4_C_P
  Top 0.203: M2.D2P 16.75,35.72 17.08,35.4 24.48,35.4 M5.DB2P
CAM3&4_D0_N
  Top 0.203: M2.CLKN 15.55,32.38 16.27,31.67 22.74,31.67 23.41,32.34 M5.CLKBN
CAM3&4_D0_P  (via drill 0.51)
  Top 0.203: M2.CLKP 15.15,31.6 15.81,30.95 v22.23,30.95 | v22.23,32.38 22.58,32.74 M5.CLKBP
  Bottom 0.203: v22.23,30.95 v22.23,32.38
CAM3&4_D1_N  (via drill 0.51)
  Top 0.203: M2.D1N 16.35,35.36 17.42,34.29 v21.11,34.29 | v21.11,32.82 21.43,33.14 M5.DB1N
  Bottom 0.203: v21.11,34.29 v21.11,32.82
CAM3&4_D1_P
  Top 0.203: M2.D1P 15.95,35.25 17.66,33.54 M5.DB1P
CAM3_C_N  (via drill 0.51 pad 0.81)
  Top 0.203: M2.DA2N 17.8,44.51 v18.3,45.01
  Bottom 0.203: v18.3,45.01 17.41,45.89 CON3.CAM_C_N
CAM3_C_P
  Top 0.203: M2.DA2P 17.15,44.97 18.38,46.2 18.38,48.86 CON3.CAM_C_P
CAM3_D0_N
  Top 0.203: M2.CLKAN 15.95,42.19 11.41,46.73 CON3.CAM_D0_N
CAM3_D0_P
  Top 0.203: M2.CLKAP 15.55,42.08 12.03,45.6 10.47,45.6 9.8,46.28 9.8,46.75 11.15,48.1 11.61,48.1 CON3.CAM_D0_P
CAM3_D1_N
  Top 0.203: M2.DA1N 16.75,46.03 16.43,46.35 16.43,47.35 14.88,48.9 CON3.CAM_D1_N
CAM3_D1_P
  Top 0.203: M2.DA1P 16.35,45.92 15.41,46.87 CON3.CAM_D1_P
CAM4_C_N  (via drill 0.51 pad 0.81)
  Top 0.203: M2.DB2N 15.15,39.33 13.61,40.88 v7.26,40.88
  Bottom 0.203: v7.26,40.88 5.5,39.12 CON4.CAM_C_N
CAM4_C_P
  Top 0.203: M2.DB2P 14.51,39.48 13.85,40.13 3.46,40.13 CON4.CAM_C_P
CAM4_D0_N
  Top 0.203: M2.CLKBN 9.76,37.42 6.07,33.73 CON4.CAM_D0_N
CAM4_D0_P
  Top 0.203: M2.CLKBP 9.6,37.82 5.87,34.09 3.48,34.09 CON4.CAM_D0_P 3.48,34.09
CAM4_D1_N
  Top 0.203: M2.DB1N 8.33,38.22 6.23,36.12 CON4.CAM_D1_N
CAM4_D1_P
  Top 0.203: M2.DB1P 8.22,38.62 6.72,37.12 CON4.CAM_D1_P
CAM5&6_C_N
  Top 0.203: M3.D2N 18.67,18.14 22.73,22.21 22.73,24.28 24.45,26 26.56,26 M6.DA2N
CAM5&6_C_P
  Top 0.203: M3.D2P 18.85,17.75 23.14,22.04 23.14,24.1 24.41,25.36 M6.DA2P
CAM5&6_D0_N
  Top 0.203: M3.CLKN 19.37,16.55 24.32,21.5 24.32,23.65 24.84,24.17 M6.CLKAN
CAM5&6_D0_P
  Top 0.203: M3.CLKP 19.47,16.14 24.69,21.36 24.69,23.38 25.08,23.77 M6.CLKAP
CAM5&6_D1_N
  Top 0.203: M3.D1N 19.06,17.34 23.53,21.86 23.53,23.96 24.53,24.96 M6.DA1N
CAM5&6_D1_P
  Top 0.203: M3.D1P 19.16,16.95 23.9,21.68 23.9,23.82 24.65,24.57 M6.DA1P
CAM5-8_C_N
  Top 0.203: M6.D2N 36.03,25.37 37.53,26.86 M7.DB2N
CAM5-8_C_P
  Top 0.203: M6.D2P 36.77,24.97 M7.DB2P
CAM5-8_D0_N  (via drill 0.51 pad 0.81)
  Top 0.203: M6.CLKN 38.18,23.77 v38.42,23.54 | v40.08,23.77 39.61,24.24 M7.CLKBN
  Bottom 0.203: v38.42,23.54 39.85,23.54 v40.08,23.77
CAM5-8_D0_P
  Top 0.203: M6.CLKP 37.31,23.37 37.9,22.78 38.7,22.78 39.21,23.3 M7.CLKBP
CAM5-8_D1_N  (via drill 0.51 pad 0.81)
  Top 0.203: M6.D1N 37.39,24.57 v37.7,24.88 | v39.01,27.86 38.81,27.66 M7.DB1N
  Bottom 0.203: v37.7,24.88 39.01,26.19 v39.01,27.86
CAM5-8_D1_P
  Top 0.203: M6.D1P 38.02,24.17 38.45,24.6 38.45,25.56 38.42,25.6 M7.DB1P
CAM5_C_N  (via drill 0.51 pad 0.81)
  Top 0.203: M3.DA2N 7.2,18.79 v7.26,18.81
  Bottom 0.203: v7.26,18.81 7.13,18.73 CON5.CAM_C_N
CAM5_C_P
  Top 0.203: M3.DA2P 7.63,18.14 7.5,18.02 3.48,18.02 CON5.CAM_C_P
CAM5_D0_N
  Top 0.203: M3.CLKAN 12.43,16.95 6.53,11.05 CON5.CAM_D0_N
CAM5_D0_P
  Top 0.203: M3.CLKAP 12.53,16.55 5.83,9.84 5.28,9.84 3.45,11.67 CON5.CAM_D0_P
CAM5_D1_N
  Top 0.203: M3.DA1N 7.75,17.75 6.08,16.07 5.08,16.07 3.45,14.45 CON5.CAM_D1_N
CAM5_D1_P
  Top 0.203: M3.DA1P 7.86,17.34 5.56,15.05 CON5.CAM_D1_P
CAM6_C_N
  Top 0.203: M3.DB2N 14.32,16.14 13.41,15.23 13.41,13.19 17.29,9.3 CON6.CAM_C_N
CAM6_C_P  (via drill 0.51 pad 0.81)
  Top 0.203: M3.DB2P 14.18,15.5 13.78,15.09 13.78,13.32 15,12.1 16.43,12.1 v16.47,12.06
  Bottom 0.203: v16.47,12.06 16.55,11.99 16.55,7.33 CON6.CAM_C_P
CAM6_D0_N
  Top 0.203: M3.CLKBN 16.75,14.99 19.44,12.31 21.86,12.31 23.54,10.64 23.54,9.32 CON6.CAM_D0_N
CAM6_D0_P
  Top 0.203: M3.CLKBP 16.35,14.89 19.3,11.94 21.11,11.94 21.19,11.87 22.58,10.48 22.58,7.37 CON6.CAM_D0_P
CAM6_D1_N
  Top 0.203: M3.DB1N 15.95,14.72 20.44,10.23 20.44,7.38 CON6.CAM_D1_N
CAM6_D1_P
  Top 0.203: M3.DB1P 15.55,14.61 19.53,10.64 19.53,9.31 CON6.CAM_D1_P
CAM7&8_C_N
  Top 0.203: M6.DB2N 25.87,22.99 25.87,21.05 28.78,18.13 39.22,18.13 39.28,18.07 M4.D2N
CAM7&8_C_P
  Top 0.203: M6.DB2P 26.24,22.21 26.24,21.22 28.96,18.5 39.44,18.5 39.69,18.26 M4.D2P
CAM7&8_D0_N
  Top 0.203: M6.CLKBN 28.18,22.25 28.64,21.8 38.13,21.8 40.88,19.05 M4.CLKN
CAM7&8_D0_P  (via drill 0.51)
  Top 0.203: M6.CLKBP 27.78,22.1 28.81,21.07 v30.44,21.07 | v30.44,22.62 30.88,22.18 38.42,22.18 41.27,19.33 M4.CLKP
  Bottom 0.203: v30.44,21.07 v30.44,22.62
CAM7&8_D1_N
  Top 0.203: M6.DB1N 27.38,21.71 28.81,20.28 38.62,20.28 40.08,18.81 M4.D1N
CAM7&8_D1_P  (via drill 0.51)
  Top 0.203: M6.DB1P 26.98,21.24 28.65,19.57 v31.63,19.57 | v31.63,21 38.42,21 40.48,18.93 M4.D1P
  Bottom 0.203: v31.63,19.57 v31.63,21
CAM7_C_N  (via drill 0.51 pad 0.81)
  Top 0.203: M4.DA2N 38.63,12.08 v38.14,11.59
  Bottom 0.203: v38.14,11.59 38.14,10.27 CON7.CAM_C_N
CAM7_C_P
  Top 0.203: M4.DA2P 39.28,11.54 38.14,10.4 38.14,7.33 CON7.CAM_C_P
CAM7_D0_N
  Top 0.203: M4.CLKAN 40.48,14.05 45.11,9.43 CON7.CAM_D0_N
CAM7_D0_P
  Top 0.203: M4.CLKAP 40.88,14.16 44.21,10.83 45.17,10.83 46.24,9.76 46.24,8.97 44.57,7.3 CON7.CAM_D0_P
CAM7_D1_N
  Top 0.203: M4.DA1N 39.68,10.28 40.12,9.84 40.12,8.89 41.71,7.3 CON7.CAM_D1_N
CAM7_D1_P
  Top 0.203: M4.DA1P 40.08,10.44 41.11,9.41 CON7.CAM_D1_P
CAM8_C_N
  Top 0.203: CON8.CAM_C_N 48.66,14.36 42.02,14.36 41.28,15.1 M4.DB2N
CAM8_C_P
  Top 0.203: CON8.CAM_C_P 53.22,16.27 51.63,17.86 50.44,17.86 47.31,14.73 42.63,14.73 M4.DB2P
CAM8_D0_N
  Top 0.203: M4.CLKBN 44.62,17.03 50.51,22.92 CON8.CAM_D0_N
CAM8_D0_P
  Top 0.203: M4.CLKBP 45.04,16.63 50.36,21.95 53.19,21.95 CON8.CAM_D0_P
CAM8_D1_N
  Top 0.203: M4.DB1N 45.96,16.23 49.65,19.92 CON8.CAM_D1_N
CAM8_D1_P
  Top 0.203: M4.DB1P 46.66,15.83 49.69,18.85 51.15,18.85 CON8.CAM_D1_P
CAM_C_N
  Top 0.203: M7.D2N 52.76,28.86 53.9,30 58.22,30 59.74,28.48 CON9.CAM_C_N
CAM_C_P
  Top 0.203: M7.D2P 57.2,28.46 CON9.CAM_C_P
CAM_CLK  (via drill 0.51)
  Top 0.203: CON6.CAM_CLK 13.52,10.99 v8.14,10.99 | CON8.CAM_CLK 61.32,12.92 61.32,32 CON9.CAM_CLK
  Bottom 0.203: CON8.CAM_CLK 35.11,12.92 CON7.CAM_CLK | v8.14,10.99 8.14,19.8 6.89,21.05 CON5.CAM_CLK 4.45,21.05 4.45,43.12 CON4.CAM_CLK 19.42,43.12 21.39,45.09 21.39,45.72 21.39,46.88 CON3.CAM_CLK 21.41,45.27 | CON9.CAM_CLK 60.96,32 60.96,37.23 52.23,37.23 | 52.23,37.23 52.23,35.15 CON1.CAM_CLK | 52.23,37.23 52.23,47.9 42.98,47.9 42.98,46.9 CON2.CAM_CLK
  Bottom 0.254: CON2.CAM_CLK 43,44.9 42.55,44.45 32.38,44.45 31.11,45.72 21.39,45.72
CAM_D0_N
  Top 0.203: M7.CLKN 52.07,27.26 55.36,23.97 58.18,23.97 59.78,22.37 CON9.CAM_D0_N
CAM_D0_P
  Top 0.203: M7.CLKP 51.96,26.86 55.82,23 CON9.CAM_D0_P
CAM_D1_N
  Top 0.203: M7.D1N 53.49,28.06 56.55,25 CON9.CAM_D1_N
CAM_D1_P  (via drill 0.51)
  Top 0.203: M7.D1P 53.39,27.66 53.86,27.19 v53.86,26.51
  Bottom 0.203: v53.86,26.51 54.36,26 CON9.CAM_D1_P
CAM_GPIO  (via drill 0.51, 0.51 pad 0.81)
  Top 0.203: v2.26,22.98 2.26,42.12 CON4.CAM_GPIO 3.45,42.59 4.92,44.05 v7.74,44.05 | v30.48,8.26 35.16,8.26 CON7.CAM_GPIO | v20.44,45.24 20.44,48.86 CON3.CAM_GPIO | CON1.CAM_GPIO 50.16,36.15 v50.16,31.11 | CON2.CAM_GPIO 42,50.48 56.08,50.48 v56.08,36.51 | v47.78,21.91 v47.78,25.96
  Bottom 0.203: v2.26,22.98 2.26,20.05 CON5.CAM_GPIO 4.45,19.06 4.45,8.26 13.56,8.26 CON6.CAM_GPIO 14.52,6.27 25.68,6.27 27.66,8.26 v30.48,8.26 | CON7.CAM_GPIO 36.11,5.56 52.23,5.56 52.23,13.92 | 52.23,13.92 47.78,13.92 v47.78,21.91 | 52.23,13.92 CON8.CAM_GPIO | v7.74,44.05 19.25,44.05 v20.44,45.24 | CON9.CAM_GPIO 50.16,31 | v50.16,31.11 50.16,31 | 50.16,31 47.78,31 v47.78,25.96 | v56.08,36.51 53.59,36.51 CON1.CAM_GPIO
D2
  Top 0.305: PI.33 68.66,51.35 68.66,39.77 68.14,39.77 66.48,38.1 66.48,36.71 67.31,35.88 67.31,33.76 U1.32
D3  (via drill 0.6)
  Top 0.305: U1.1 66.83,32.31 66.83,35.68 65.41,37.11 65.41,38.1 v67.83,40.52
  Bottom 0.305: v67.83,40.52 67.83,49.86 PI.31
D4  (via drill 0.6)
  Top 0.305: U1.2 72.69,31.11 66.87,31.11 66,31.99 66,35.6 64.14,37.47 64.14,38.46 v66.72,41.04
  Bottom 0.305: v66.72,41.04 66.72,49.45 64.73,51.44 63.71,51.44 PI.29
D8
  Top 0.305: U1.12 80.34,36.15 82.86,38.66 Q1.1
GND  (via drill 0.51)
  Top 0.203: 36.83,17.03 v34.92,17.14 | M7./OE 39.41,29.51 v39.41,33.22 | M6.GND 27.98,26.02 27.98,26.95 v28.1,27.07 | M3.GND 16.55,18.79 v16.55,21.43 | M5./OE 29.23,32.54 v30.52,32.54 | M1./OE 39.89,37.64 v39.89,36.04 | M2.GND 17.8,37.62 v19.33,37.62 | CON5.GND1 2.54,16.05 2.54,19.05 CON5.GND
  Top 0.254: v34.92,17.14 37.9,17.14 37.9,16.83 38.63,16.83 M4.GND
  other vias: 83.11,31.15 58.1,40.6 69.45,29.17 73.54,33.97 82.79,37.39 32.9,34.61 62.23,30.4 80.88,41.2
  pour Bottom: 0,57.15 85.09,57.15 85.09,27.94 61.59,27.94 61.59,0 0,0
  pour Top: 0,57.15 85.09,57.15 85.09,27.94 61.59,27.94 61.59,0 0,0
MISO
  Top 0.305: U1.16 78.93,44.45 78.11,44.45 78.11,45.92 ISP1.1
MOSI  (via drill 0.51)
  Top 0.305: v77.51,38.58 77.51,38.56 U1.15
  Bottom 0.305: v77.51,38.58 77.51,41.43 ISP1.4
N$1
  Top 0.305: J1.1 15.88,56.04 35,56.04 35.76,55.28 PI.08
N$2  (via drill 0.6)
  Top 0.305: U1.11 76.04,35.36 v73.7,37.7 | v63.38,49.21 62.87,48.7 SJ3.3
  Bottom 0.305: v73.7,37.7 71.83,39.57 65.72,39.57 65.72,49.21 v63.38,49.21
N$3
  Top 0.305: C19.1 74.3,49.53 72.95,48.18 72.95,43.81 73.74,43.02 75.09,43.02 75.1,43.01 U1.20
N$4  (via drill 0.6)
  Top 0.305: U1.10 75.67,34.55 v73.74,36.47 | v64.25,44.65 64.25,44.63 SJ2.3
  Bottom 0.305: v73.74,36.47 71.12,39.09 65.25,39.09 65.25,44.65 v64.25,44.65
N$5  (via drill 0.51)
  Top 0.305: v64.29,41.43 64.28,41.45 SJ1.3 | U1.9 75.62,33.76 73.9,35.48 73.5,35.48 v72.39,36.59
  Bottom 0.305: v72.39,36.59 70.44,38.54 64.29,38.54 v64.29,41.43
N$7
  Top 0.305: J1.2 20.32,53.34 22.23,55.24 24.77,55.24 27.3,52.7 36.99,52.7 PI.10
N$8
  Top 0.305: J3.3 83.17,41.29 Q1.2
N$10
  Bottom 0.305: PI.03 29.57,50.36 28.34,50.36 RT1.7
N$11
  Bottom 0.305: PI.05 32.39,50.64 31.23,50.64 30.4,49.81 29.61,49.81 RT1.8
N$12  (via drill 0.51)
  Top 0.305: PI.01 28.13,46.76 v31.39,43.5
  Bottom 0.305: v31.39,43.5 30.48,44.41 30.48,45.09 28.34,45.09 RT1.2
PWM
  Top 0.305: U1.13 80.42,36.96 82.07,38.62 82.07,39.61 84.26,39.61 84.26,47.9 J3.1
RESET  (via drill 0.51)
  Top 0.305: v72.35,35.04 71.56,35.84 71.56,36.15 U1.29 | SW1.1 SW1.3 82.39,28.81 80.01,28.81 | 80.01,28.81 72.35,28.81 v72.35,29.61 | R1.1 80.01,29.77 80.01,28.81
  Bottom 0.305: ISP1.5 72.95,46 72.95,43.26 74.93,41.27 74.93,34.92 72.47,34.92 v72.35,35.04 v72.35,29.61
RX  (via drill 0.51)
  Top 0.305: U1.30 69.3,35.36 v68.9,35.76
SCK
  Top 0.305: ISP1.3 75.49,46 75.49,44.25 76.83,42.9 77.49,42.9 U1.17
SCL  (via drill 0.51)
  Top 0.203: CON5.SCL 2.06,22.05 | 2.06,22.05 1.43,22.05 1.43,44.12 CON4.SCL 3.48,44.12 4.45,45.09 4.45,46.12 8.93,50.6 20.7,50.6 CON3.SCL | CON6.SCL 11.56,8.26 2.06,8.26 2.06,22.05 | CON1.SCL 53.22,33.7 52.07,32.54 52.07,31.11 55.86,31.11 CON9.SCL 58.3,32.45 58.3,31.99 59.21,31.07 60.84,31.07 60.84,15.24 v58.42,15.24 | v47.15,45.72 47.15,47.9 43.97,47.9 43.97,48.9 CON2.SCL
  Bottom 0.203: CON7.SCL 34.11,5.91 | 34.11,5.91 34.11,5.08 55.24,5.08 55.24,11.92 CON8.SCL 58.42,11.92 v58.42,15.24 | CON6.SCL 12.52,5.91 34.11,5.91 | CON1.SCL 50.31,34.15 50.31,34.38 47.62,37.07 47.62,42.7 47.15,43.18 v47.15,45.72
SCL_IMU  (via drill 0.51)
  Top 0.305: v22.86,29.84 14.29,29.84 | U$2.SCL 11.43,31.75 13.34,29.84 14.29,29.84 | R3.1 14.29,29.84 | U1.28 v68.1,36.96 v68.1,36.95
  Bottom 0.305: v22.86,29.84 22.86,22.7 27.34,18.22 42.35,18.22 49.09,24.96 54.21,24.96 54.21,19.01 61.24,19.01 61.24,28.73 67.94,28.73 67.94,36.95 v68.1,36.95
SDA  (via drill 0.51)
  Top 0.203: CON5.SDA 5.45,22.49 8.26,19.68 v12.06,19.68 | CON3.SDA 28.39,41.91 v36.2,41.91 | CON4.SDA 8.22,45.12 v11.43,41.91
  Bottom 0.203: CON8.SDA 48.63,8.33 33.11,8.33 CON7.SDA 25.62,9.3 21.59,13.34 15.55,13.34 | 15.55,13.34 CON6.SDA | v12.06,19.68 12.06,16.82 15.55,13.34 | CON4.SDA 8.17,45.12 11.03,47.98 22.32,47.98 CON3.SDA | v36.2,41.91 42.03,41.91 44.97,44.85 | 44.97,44.85 44.97,46.86 CON2.SDA | CON9.SDA 54.56,34 53.7,33.14 CON1.SDA | CON1.SDA | CON1.SDA 49.93,33.14 49.93,34.09 46.99,36.99 46.99,41.91 44.97,43.93 44.97,44.85 | v11.43,41.91 6.99,37.47 6.99,24.77 5.45,23.23 CON5.SDA
SDA_IMU  (via drill 0.51)
  Top 0.305: U1.27 v67.31,37.75 v67.31,37.74 | v24.13,28.73 12.06,28.73 | 12.06,28.73 8.93,28.73 U$2.SDA | R2.1 12.06,28.73
  Bottom 0.305: v67.31,37.74 67.31,29.21 60.72,29.21 60.76,19.57 54.73,19.57 54.73,25.52 48.97,25.52 42.19,18.73 27.62,18.73 24.13,22.23 v24.13,28.73
SEL1  (via drill 0.51)
  Top 0.203: M2.SEL 19.8,38.62 v20.32,38.1 | v13.97,20.32 14.68,20.32 15.56,19.45 M3.SEL | v31.75,12.7 34.88,15.83 M4.SEL | M1.SEL 40.88,37.1 41.23,36.75 v41.23,34.92 41.23,31.16 42.19,30.2 v53.06,30.2 | SJ1.2 v61.44,40.64
  Bottom 0.203: v20.32,38.1 20.32,36.2 | 20.32,36.2 20.32,26.67 | 20.32,26.67 v13.97,20.32 | 20.32,26.67 20.32,15.88 23.5,12.7 v31.75,12.7 | v41.23,34.92 34.29,34.92 33.02,36.2 20.32,36.2 | v53.06,30.2 53.3,29.96 58.18,29.96 59.29,31.07 61.44,31.07 v61.44,40.64
SEL1_PI
  Top 0.305: PI.11 42.11,51.46 42.11,55.96 67.23,55.96 67.27,43.04 64.02,39.83 SJ1.1
SEL2  (via drill 0.51)
  Top 0.203: M5.SEL 29.84,33.54 31.23,34.92 v31.75,34.92 33.66,36.83 v36.2,36.83 | SJ2.2 v59.69,43.81 | v53.22,47.74 51.4,47.74 49.17,45.52 49.17,45.32 v44.73,40.88 | M6.SEL 26.98,26.83 26.59,27.23 v26.04,27.23
  Bottom 0.203: v31.75,34.92 31.75,32.38 26.59,27.23 v26.04,27.23 | v59.69,43.81 55.76,47.74 v53.22,47.74 | v44.73,40.88 40.24,40.88 v36.2,36.83
SEL2_PI
  Top 0.305: PI.13 44.61,52.69 44.61,55.36 65.21,55.36 65.21,43 SJ2.1
SEL3  (via drill 0.51)
  Top 0.203: SJ3.2 v59.69,46.99 | v52.07,48.9 51.44,48.9 v45.01,42.47 | v35.56,31.75 36.75,31.75 38.42,30.08 M7.SEL
  Bottom 0.203: v59.69,46.99 57.78,46.99 55.88,48.9 v52.07,48.9 | v45.01,42.47 46.35,41.12 46.35,33.02 45.09,31.75 v35.56,31.75
SEL3_PI
  Top 0.305: SJ3.1 64,46.18 64.69,46.99 64.69,52.78 45.96,52.78 PI.15
TX  (via drill 0.51)
  Top 0.305: U1.31 69,34.55 v68.98,34.57
VBAT  (via drill 0.51)
  Top 0.305: v26.35,50.88 26.35,46.04 29.84,42.55 32.38,42.55 v33.02,43.18
  Bottom 0.305: S1.VDD 43.89,35.48 40.64,38.73 40.01,38.73 37.11,35.84 34.65,35.84 30.48,40.01 | 30.48,40.01 29.63,40.85 C21.1 | RT1.6 27.07,50.16 v26.35,50.88 | v33.02,43.18 33.02,42.55 30.48,40.01
XTAL1
  Top 0.305: U1.7 76.7,30.88 80.64,30.88 80.64,33.97 83.99,33.97 X1.XTAL1
XTAL2
  Top 0.305: 77.49,32.03 U1.8 80.13,32.31 80.13,35.48 X1.XTAL2

### Text on the board
tNames: Octaplexer v6 D.Trafford, S.Tamke, G.Milheim